# Altium project VM02_hv2.PrjPcb
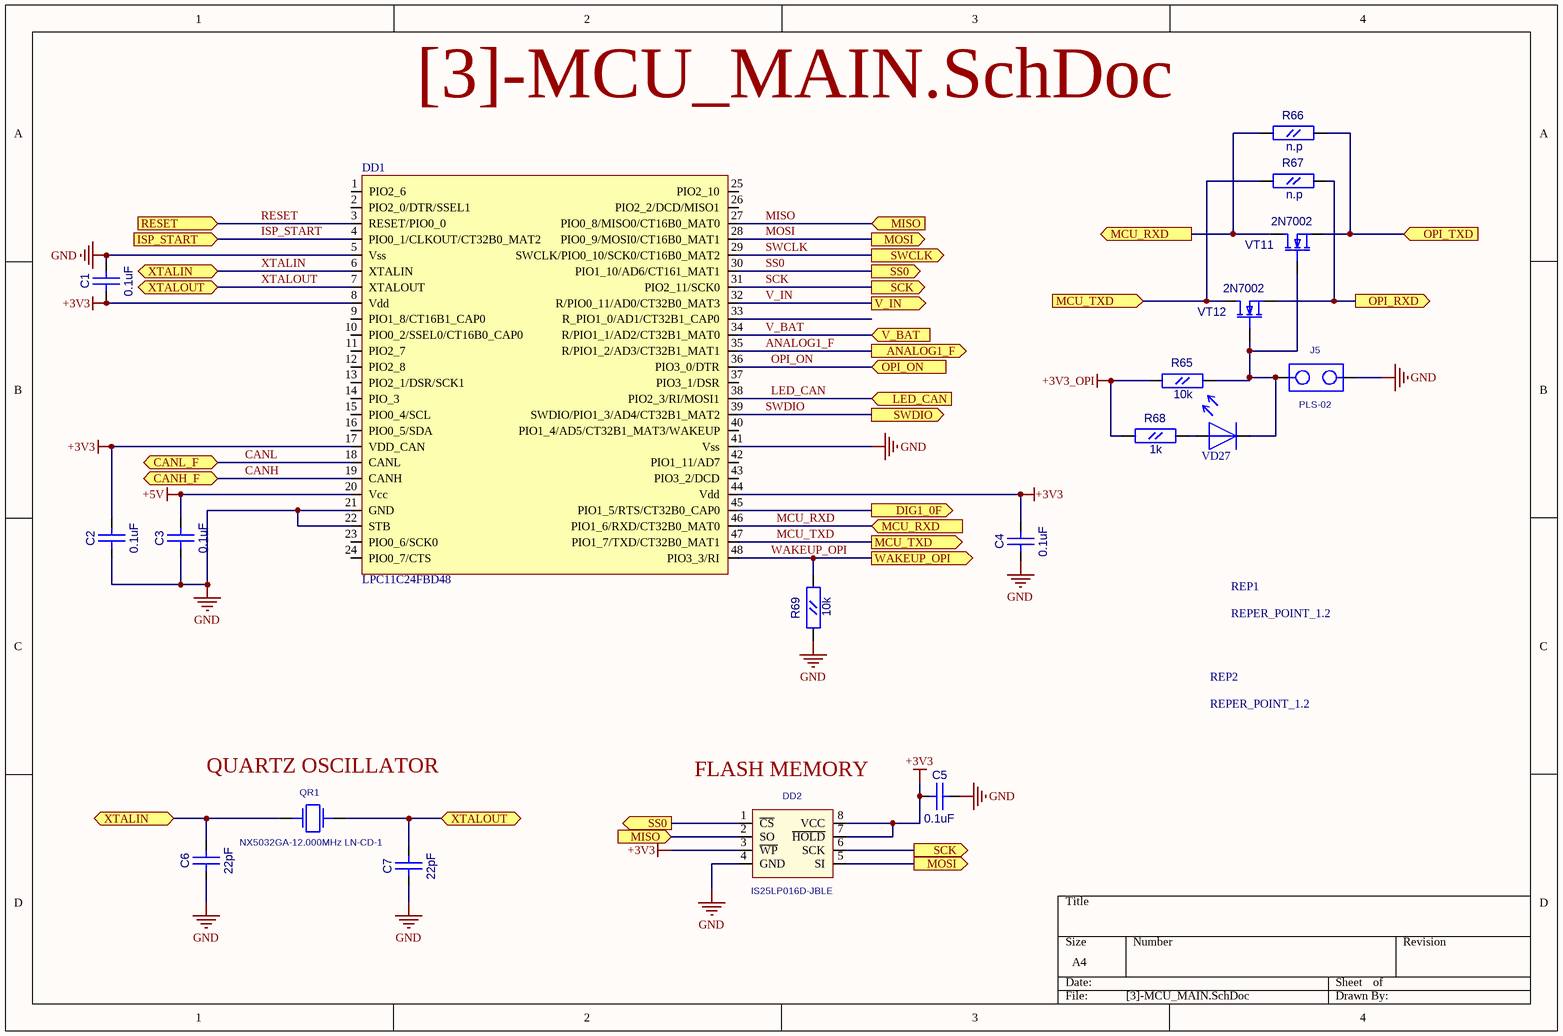
[diagram p0: [3]-MCU_MAIN.SchDoc]
10 sheets, 154 parts. Net scope: flat (ports and power ports of the same name join across sheets).
Board file: VM02_hv2.PcbDoc
Sheets:
  [3]-MCU_MAIN.SchDoc
  [4]-MCU_POWER.SchDoc
  [5]-OPI_MAIN.SchDoc
  [7]-GSM_MODEM_MAIN.SchDoc
  [8]-GSM_MODEM_CONNECTORS.SchDoc
  [9]-CAMERA_POWER_CONTROLLER.SchDoc
  [10]-MAIN_POWER.SchDoc
  [11]-BATTERY_BACKUP.SchDoc
  [14]-MAIN_CONNECTORS.SchDoc
  [15]-MCU_CONNECTORS.SchDoc

## Sheet [3]-MCU_MAIN.SchDoc
size A4

### Parts
C1  0.1uF  [CC0603]
C2  0.1uF  [CC0603]
C3  0.1uF  [CC0603]
C4  0.1uF  [CC0603]
C5  0.1uF  [CC0603]
C6  22pF  [CC0603]
C7  22pF  [CC0603]
DD1  LPC11C24FBD48  [LQFP48]
DD2  IS25LP016D-JBLE  [EIAJ_SO8]
J5  PLS-02  [PLS-02]
QR1  NX5032GA-12.000MHz LN-CD-1  [AC5032_2]
R65  10k  [RC0603]
R66  n.p  [RC0603]
R67  n.p  [RC0603]
R68  1k  [RC0603]
R69  10k  [RC0603]
REP1  REPER_POINT_1.2  [REPER1.2]
REP2  REPER_POINT_1.2  [REPER1.2]
VD27  LED_0805  [LED0805]  (value not drawn)
VT11  2N7002  [SOT-23(123)]
VT12  2N7002  [SOT-23(123)]

### Ports
ANALOG1_F (out), CANH_F (bidir), CANL_F (bidir), DIG1_0F (out), ISP_START (in), LED_CAN (in), MCU_RXD (in), MCU_RXD (out), MCU_TXD (in), MCU_TXD (out), MISO (in), MOSI (out), OPI_ON (in), OPI_RXD (out), OPI_TXD (in), RESET (in), SCK (out), SS0 (out), SWCLK (out), SWDIO (out), V_BAT (in), V_IN (out), WAKEUP_OPI (out), XTALIN (bidir), XTALOUT (bidir)

### Nets
+3V3: C1.1(A) C2.2(B) C4.2(B) C5.1(A) DD1.8(Vdd) DD1.17(VDD_CAN) DD1.44(Vdd) DD2.3(~{WP}) DD2.7(~{HOLD}) DD2.8(VCC)
+3V3_OPI: R65.1(A) R68.1(A)
+5V: C3.2(B) DD1.20(Vcc)
GND: C1.2(B) C2.1(A) C3.1(A) C4.1(A) C5.2(B) C6.1(A) C7.1(A) DD1.5(Vss) DD1.21(GND) DD1.22(STB) DD1.41(Vss) DD2.4(GND) J5.2 R69.1(A)
ANALOG1_F: DD1.35(R/PIO1_2/AD3/CT32B1_MAT1) ; port ANALOG1_F
CANH: DD1.19(CANH) ; port CANH_F
CANL: DD1.18(CANL) ; port CANL_F
ISP_START: DD1.4(PIO0_1/CLKOUT/CT32B0_MAT2) ; port ISP_START
LED_CAN: DD1.38(PIO2_3/RI/MOSI1) ; port LED_CAN
MCU_RXD: DD1.46(PIO1_6/RXD/CT32B0_MAT0) R66.1(A) VT11.3(D) ; port MCU_RXD
MCU_TXD: DD1.47(PIO1_7/TXD/CT32B0_MAT1) R67.1(A) VT12.3(D) ; port MCU_TXD
MISO: DD1.27(PIO0_8/MISO0/CT16B0_MAT0) DD2.2(SO) ; port MISO
MOSI: DD1.28(PIO0_9/MOSI0/CT16B0_MAT1) DD2.5(SI) ; port MOSI
OPI_ON: DD1.36(PIO3_0/DTR) ; port OPI_ON
RESET: DD1.3(RESET/PIO0_0) ; port RESET
SCK: DD1.31(PIO2_11/SCK0) DD2.6(SCK) ; port SCK
SS0: DD1.30(PIO1_10/AD6/CT161_MAT1) DD2.1(~{CS}) ; port SS0
SWCLK: DD1.29(SWCLK/PIO0_10/SCK0/CT16B0_MAT2) ; port SWCLK
SWDIO: DD1.39(SWDIO/PIO1_3/AD4/CT32B1_MAT2) ; port SWDIO
V_BAT: DD1.34(R/PIO1_1/AD2/CT32B1_MAT0) ; port V_BAT
V_IN: DD1.32(R/PIO0_11/AD0/CT32B0_MAT3) ; port V_IN
WAKEUP_OPI: DD1.48(PIO3_3/RI) R69.2(B) ; port WAKEUP_OPI
XTALIN: C6.2(B) DD1.6(XTALIN) QR1.1 ; port XTALIN
XTALOUT: C7.2(B) DD1.7(XTALOUT) QR1.2 ; port XTALOUT
NetDD1_45: DD1.45(PIO1_5/RTS/CT32B0_CAP0) ; port DIG1_0F
NetJ5_1: J5.1 R65.2(B) VD27.2 VT11.1(G) VT12.1(G)
NetR66_2: R66.2(B) VT11.2(S) ; port OPI_TXD
NetR67_2: R67.2(B) VT12.2(S) ; port OPI_RXD
NetR68_2: R68.2(B) VD27.1

Not connected (* = marked no-connect by the designer): DD1 1(PIO2_6) 2(PIO2_0/DTR/SSEL1) 9(PIO1_8/CT16B1_CAP0) 10(PIO0_2/SSEL0/CT16B0_CAP0) 11(PIO2_7) 12(PIO2_8) 13(PIO2_1/DSR/SCK1) 14(PIO_3) 15(PIO0_4/SCL) 16(PIO0_5/SDA) 23(PIO0_6/SCK0) 24(PIO0_7/CTS) 25(PIO2_10) 26(PIO2_2/DCD/MISO1) 33(R_PIO1_0/AD1/CT32B1_CAP0) 37(PIO3_1/DSR) 40(PIO1_4/AD5/CT32B1_MAT3/WAKEUP) 42(PIO1_11/AD7) 43(PIO3_2/DCD); REP1 1; REP2 1

### Notes on the sheet
- (near QR1) QUARTZ OSCILLATOR
- (near DD2) FLASH MEMORY

### Library data of the parts
C1-C7 = CC0603
  C1-C5: Value: 0.1uF
  C6 C7: Value: 22pF
DD2 = S25FL016A0LMFI01: Value: IS25LP016D-JBLE
QR1 = AC5032_2: AC5032/2; Value: NX5032GA-12.000MHz LN-CD-1
R65-R69 = RC0603
  R65 R69: Value: 10k
  R66 R67: Value: n.p
  R68: Value: 1k
REP1 REP2 = REPER1.2: Value: REPER_POINT_1.2
VT11 VT12 = 2N7002: N-Channel Enhancement Mode Vertical DMOS FET; OriginalName: 2N7002; Value: *
DD1 = LPC11C24FBD48: Value: LPC11C24FBD48
J5 = PLS-02: Value: *
VD27 = LED_0805: Value: LED_0805

## Sheet [4]-MCU_POWER.SchDoc
size A4
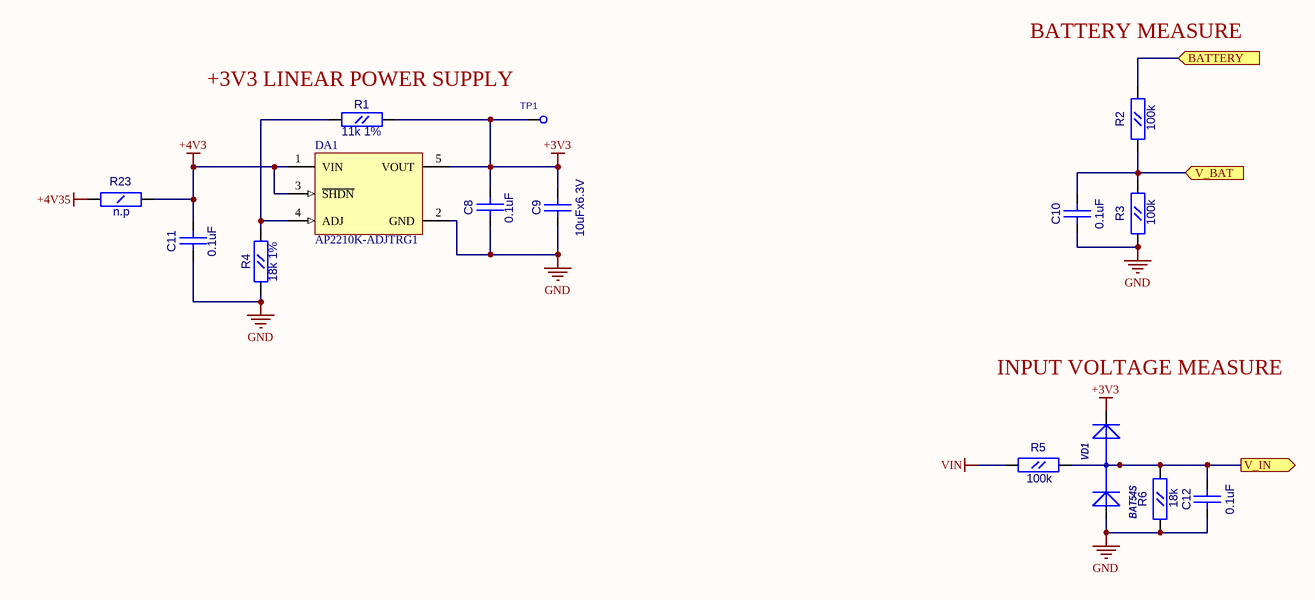
[diagram p1: [4]-MCU_POWER.SchDoc]

### Parts
C8  0.1uF  [CC0603]
C9  10uFx6.3V  [CC0805]
C10  0.1uF  [CC0603]
C11  0.1uF  [CC0603]
C12  0.1uF  [CC0603]
DA1  AP2210K-ADJTRG1  [SOT23-5]
R1  11k 1%  [RC0603]
R2  100k  [RC0603]
R3  100k  [RC0603]
R4  18k 1%  [RC0603]
R5  100k  [RC0603]
R6  18k  [RC0603]
R23  n.p  [RC1206]
TP1  TESTPOINT1  [TESTPOINT1]  (value not drawn)
VD1  BAT54S  [SOT-23(GSD)]

### Ports
BATTERY (in), V_BAT (in), V_IN (out)

### Nets
+3V3: C8.1(A) C9.2(B) DA1.5(VOUT) R1.2(B) TP1.1 VD1.2(K)
+4V3: C11.1(A) DA1.1(VIN) DA1.3(~{SHDN}) R23.2(B)
+4V35: R23.1(A)
+VBAT: R2.2(B) ; port BATTERY
GND: C8.2(B) C9.1(A) C10.1(A) C11.2(B) C12.1(A) DA1.2(GND) R3.1(A) R4.1(A) R6.1(A) VD1.1(A)
VIN: R5.1(A)
V_BAT: C10.2(B) R2.1(A) R3.2(B) ; port V_BAT
V_IN: C12.2(B) R5.2(B) R6.2(B) VD1.3(AK) ; port V_IN
NetDA1_4: DA1.4(ADJ) R1.1(A) R4.2(B)

### Notes on the sheet
- (near R1) +3V3 LINEAR POWER SUPPLY
- BATTERY MEASURE
- (near VD1) INPUT VOLTAGE MEASURE

### Library data of the parts
C8 C10-C12 = CC0603: Value: 0.1uF
C9 = CC0805: Value: 10uFx6.3V
DA1 = MCP1824T-ADJE/OT: 300 mA, Low Voltage, Low Quiescent Current LDO Regulator, 5-Pin SOT-223, Extended Temperature, Tape and Reel; Published: 29-Jan-2009; DatasheetVersion: revA, Aug-2007; PackageVersion: revAW, Oct-2008; PackageReference: SOT-223-DC5; Publisher: Altium Limited; PackageDescription: 5-Lead Plastic Small Outline Transistor (DC) [SOT-223]; ComponentLink1Description: Manufacturer Link; ComponentLink1URL: http://www.microchip.com; ComponentLink2Description: Datasheet; ComponentLink2URL: http://ww1.microchip.com/downloads/en/DeviceDoc/22070a.pdf; ComponentLink3Description: Packaging Specification; ComponentLink3URL: http://ww1.microchip.com/downloads/en/PackagingSpec/00049AW.pdf
R1-R6 = RC0603
  R1: Value: 11k 1%
  R2 R3 R5: Value: 100k
  R4: Value: 18k 1%
  R6: Value: 18k
R23 = RC1206: Value: n.p
VD1 = BAT54S: 1.0 Ampere General Purpose Rectifier; ComponentField6: Published 8-Jun-2000, Modified 11-July-2000: SIM Model Added.; Value: *
TP1 = TESTPOINT1: Value: *

## Sheet [5]-OPI_MAIN.SchDoc
size A4
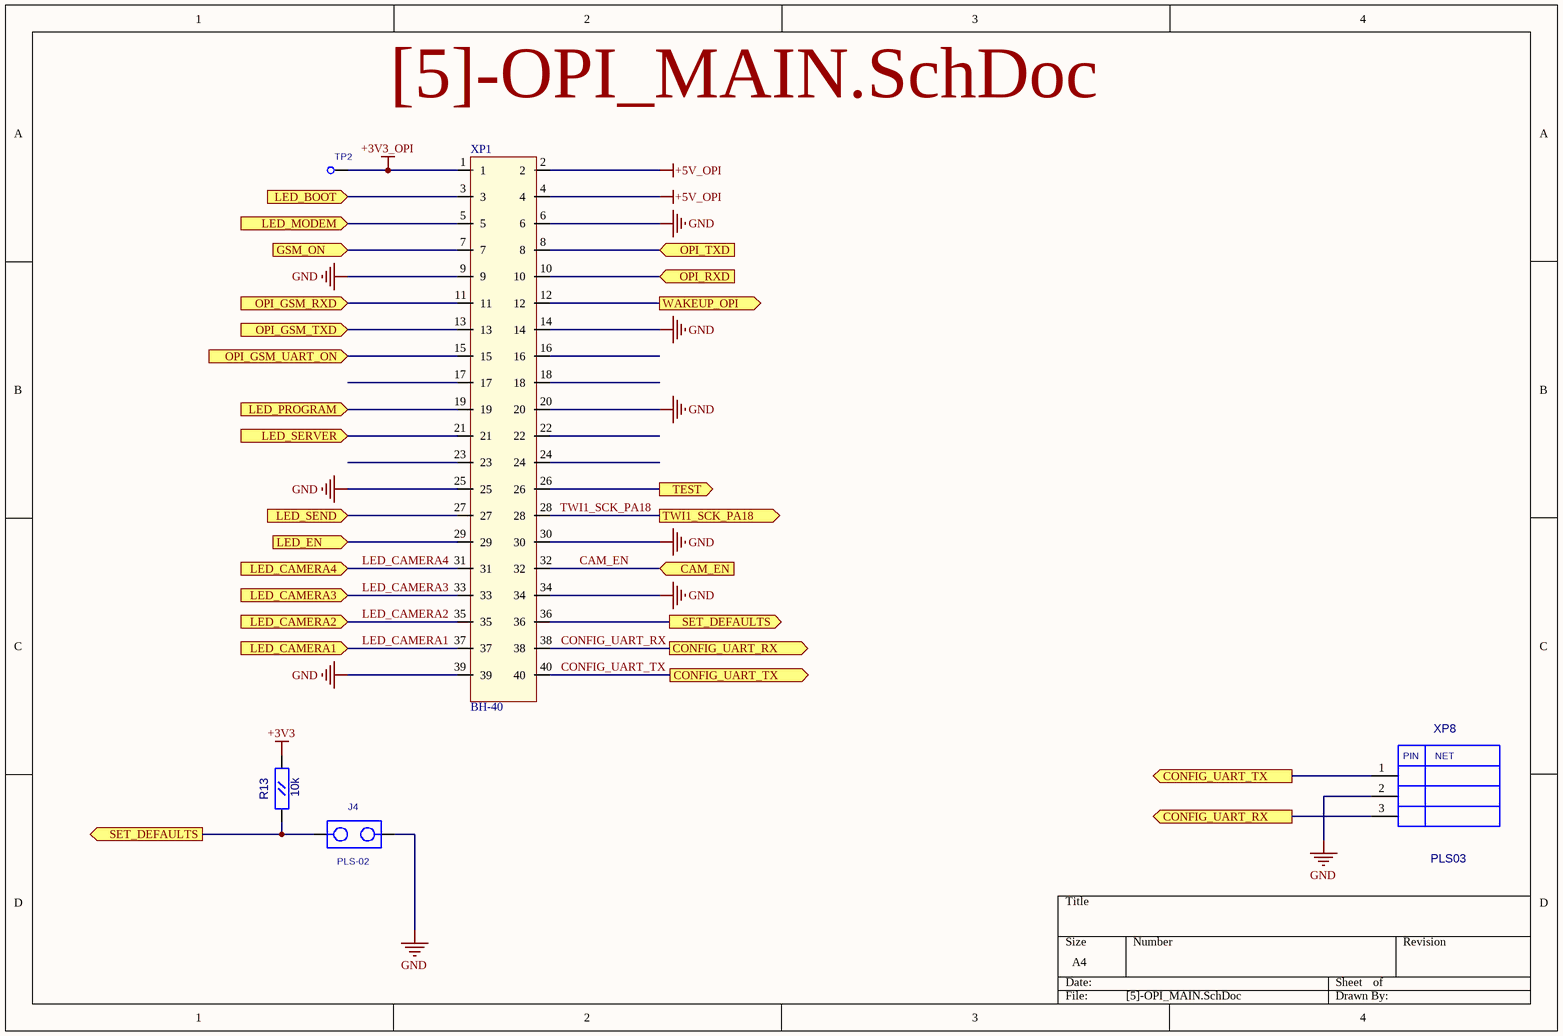
[diagram p2: [5]-OPI_MAIN.SchDoc]

### Parts
J4  PLS-02  [PLS-02]
R13  10k  [RC0603]
TP2  TESTPOINT1  [TESTPOINT1]  (value not drawn)
XP1  BH-40  [BH-40]
XP8  PLS03  [PLS-03]

### Ports
CAM_EN (in), CONFIG_UART_RX (out), CONFIG_UART_TX (out), GSM_ON (in), LED_BOOT (in), LED_CAMERA1 (in), LED_CAMERA2 (in), LED_CAMERA3 (in), LED_CAMERA4 (in), LED_EN (in), LED_MODEM (in), LED_PROGRAM (in), LED_SEND (in), LED_SERVER (in), OPI_GSM_RXD (in), OPI_GSM_TXD (in), OPI_GSM_UART_ON (in), OPI_RXD (in), OPI_TXD (in), SET_DEFAULTS (out), TEST (out), TWI1_SCK_PA18 (out), WAKEUP_OPI (out)

### Nets
+3V3: R13.2(B)
+3V3_OPI: TP2.1 XP1.1
+5V_OPI: XP1.2 XP1.4
GND: J4.2 XP1.6 XP1.9 XP1.14 XP1.20 XP1.25 XP1.30 XP1.34 XP1.39 XP8.2
CAM_EN: XP1.32 ; port CAM_EN
CONFIG_UART_RX: XP1.38 XP8.3 ; port CONFIG_UART_RX
CONFIG_UART_TX: XP1.40 XP8.1 ; port CONFIG_UART_TX
LED_CAMERA1: XP1.37 ; port LED_CAMERA1
LED_CAMERA2: XP1.35 ; port LED_CAMERA2
LED_CAMERA3: XP1.33 ; port LED_CAMERA3
LED_CAMERA4: XP1.31 ; port LED_CAMERA4
TWI1_SCK_PA18: XP1.28 ; port TWI1_SCK_PA18
WAKEUP_OPI: XP1.12 ; port WAKEUP_OPI
NetJ4_1: J4.1 R13.1(A) XP1.36 ; port SET_DEFAULTS
NetR16_2: XP1.7 ; port GSM_ON
NetR18_1: XP1.15 ; port OPI_GSM_UART_ON
NetR63_1: XP1.26 ; port TEST
NetR66_2: XP1.8 ; port OPI_TXD
NetR67_2: XP1.10 ; port OPI_RXD
NetR71_1: XP1.29 ; port LED_EN
NetVT5_3: XP1.13 ; port OPI_GSM_TXD
NetVT6_3: XP1.11 ; port OPI_GSM_RXD
NetXP1_3: XP1.3 ; port LED_BOOT
NetXP1_5: XP1.5 ; port LED_MODEM
NetXP1_19: XP1.19 ; port LED_PROGRAM
NetXP1_21: XP1.21 ; port LED_SERVER
NetXP1_27: XP1.27 ; port LED_SEND

Not connected (* = marked no-connect by the designer): XP1 16 17 18 22 23 24

### Notes on the sheet
- (in symbol PLS03) PIN; NET

### Library data of the parts
R13 = RC0603: Value: 10k
XP1 = BH-40: 2.54mm connector with key; Value: BH-40
J4 = PLS-02: Value: *
TP2 = TESTPOINT1: Value: *
XP8 = PLS03: Value: *

## Sheet [7]-GSM_MODEM_MAIN.SchDoc
size A4
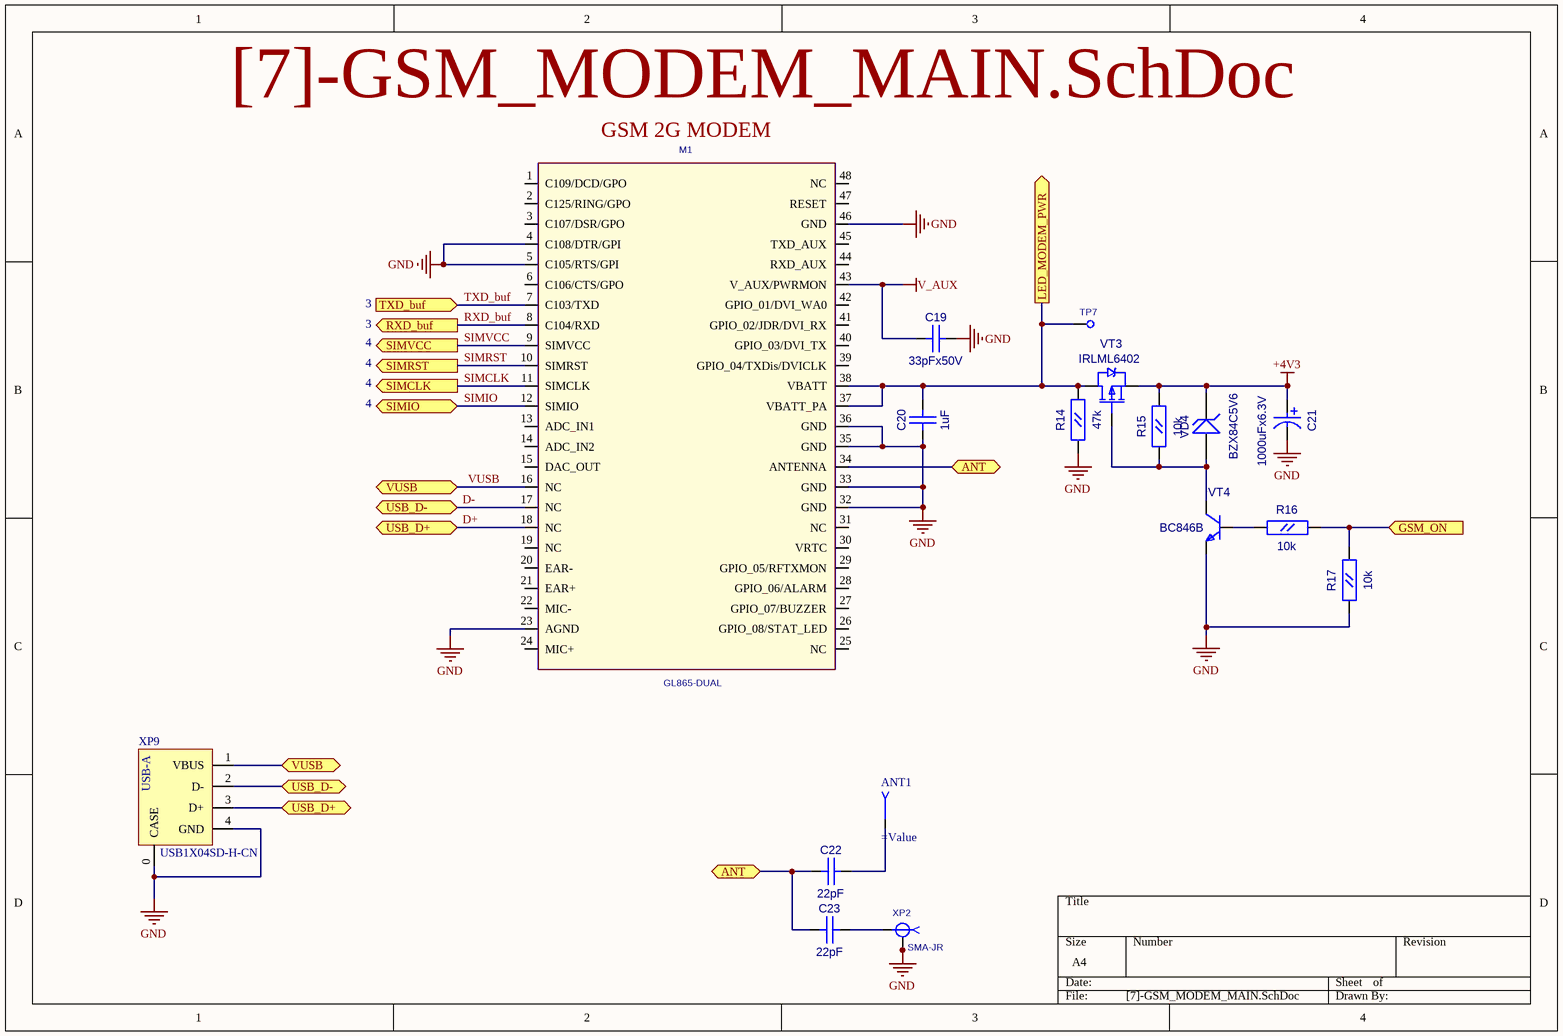
[diagram p3: [7]-GSM_MODEM_MAIN.SchDoc]

### Parts
ANT1  (no value)  [GSM_ANTENNA_MEANDER]
C19  33pFx50V  [CC0603]
C20  1uF  [CC0603]
C21  value 1000uFx6.3V  [CC8X3.5]  (hidden comment: CAP0.35)
C22  22pF  [CC0603]
C23  22pF  [CC0603]
M1  GL865-DUAL  [GL868-DUAL]
R14  47k  [RC0603]
R15  10k  [RC0603]
R16  10k  [RC0603]
R17  10k  [RC0603]
TP7  TESTPOINT1  [TESTPOINT1]  (value not drawn)
VD4  BZX84C5V6  [SOT-23(123)]
VT3  IRLML6402  [SOT-23(123)]
VT4  BC846B  [SOT-23(123)]
XP2  SMA-JR  [SMA-JR]
XP9  USB1X04SD-H-CN  [USB_A_FRONT]

### Ports
ANT (bidir), GSM_ON (in), LED_MODEM_PWR (out), RXD_buf (out), SIMCLK (out), SIMIO (bidir), SIMRST (out), SIMVCC (out), TXD_buf (in), USB_D+ (bidir), USB_D- (bidir), VUSB (bidir)

### Nets
+4V3: C21.1 R15.2(B) VD4.3(K) VT3.2(S)
GND: C19.2(B) C20.1(A) C21.2 M1.4(C108/DTR/GPI) M1.5(C105/RTS/GPI) M1.23(AGND) M1.32(GND) M1.33(GND) M1.35(GND) M1.36(GND) M1.46(GND) R14.1(A) R17.1(A) VT4.2(E) XP2.2 XP2.3 XP2.4 XP2.5 XP9.0(CASE) XP9.4(GND)
V_AUX: C19.1(A) M1.43(V_AUX/PWRMON)
D+: M1.18(NC) XP9.3(D+) ; port USB_D+
D-: M1.17(NC) XP9.2(D-) ; port USB_D-
RXD_buf: M1.8(C104/RXD) ; port RXD_buf
SIMCLK: M1.11(SIMCLK) ; port SIMCLK
SIMIO: M1.12(SIMIO) ; port SIMIO
SIMRST: M1.10(SIMRST) ; port SIMRST
SIMVCC: M1.9(SIMVCC) ; port SIMVCC
TXD_buf: M1.7(C103/TXD) ; port TXD_buf
VUSB: M1.16(NC) XP9.1(VBUS) ; port VUSB
NetANT1_1: ANT1.1 C22.2(B)
NetC20_2: C20.2(B) M1.37(VBATT_PA) M1.38(VBATT) R14.2(B) TP7.1 VT3.3(D) ; port LED_MODEM_PWR
NetC22_1: C22.1(A) C23.1(A) M1.34(ANTENNA) ; port ANT
NetC23_2: C23.2(B) XP2.1
NetR15_1: R15.1(A) VD4.1(A) VT3.1(G) VT4.3(C)
NetR16_1: R16.1(A) VT4.1(B)
NetR16_2: R16.2(B) R17.2(B) ; port GSM_ON

Not connected (* = marked no-connect by the designer): M1 1(C109/DCD/GPO) 2(C125/RING/GPO) 3(C107/DSR/GPO) 6(C106/CTS/GPO) 13(ADC_IN1) 14(ADC_IN2) 15(DAC_OUT) 19(NC) 20(EAR-) 21(EAR+) 22(MIC-) 24(MIC+) 25(NC) 26(GPIO_08/STAT_LED) 27(GPIO_07/BUZZER) 28(GPIO_06/ALARM) 29(GPIO_05/RFTXMON) 30(VRTC) 31(NC) 39(GPIO_04/TXDis/DVICLK) 40(GPIO_03/DVI_TX) 41(GPIO_02/JDR/DVI_RX) 42(GPIO_01/DVI_WA0) 44(RXD_AUX) 45(TXD_AUX) 47(RESET) 48(NC)

### Notes on the sheet
- (near M1) GSM 2G MODEM
- 3
- 4
- (in symbol USB_A_VERTICAL) USB-A

### Library data of the parts
ANT1 = GSM_ANTENNA_MEANDR: 900-1800 Meandered GSM antenna 1.6mm FR4
C19 C20 C22 C23 = CC0603
  C19: Value: 33pFx50V
  C20: Value: 1uF
  C22 C23: Value: 22pF
M1 = GL868-DUAL: Value: *
R14-R17 = RC0603
  R14: Value: 47k
  R15-R17: Value: 10k
VD4 = BZX84: Zener Voltage Regulator Diode; Value: BZX84C5V6
VT3 = IRLML6402: HEXFET Power MOSFET; OriginalName: IRLML5103; ComponentField7: Published 8-Jun-2000; Value: IRLML6402
VT4 = BC846BLT1: ComponentField7: Published 29-Sep-2000; OriginalName: BC846BLT1; Value: BC846B
XP9 = USB_A_VERTICAL: Vertical USB connetctor,type A.THR; Value: USB1X04SD-H-CN
TP7 = TESTPOINT1: Value: *
XP2 = SMA-JR: Value: *

## Sheet [8]-GSM_MODEM_CONNECTORS.SchDoc
size A4
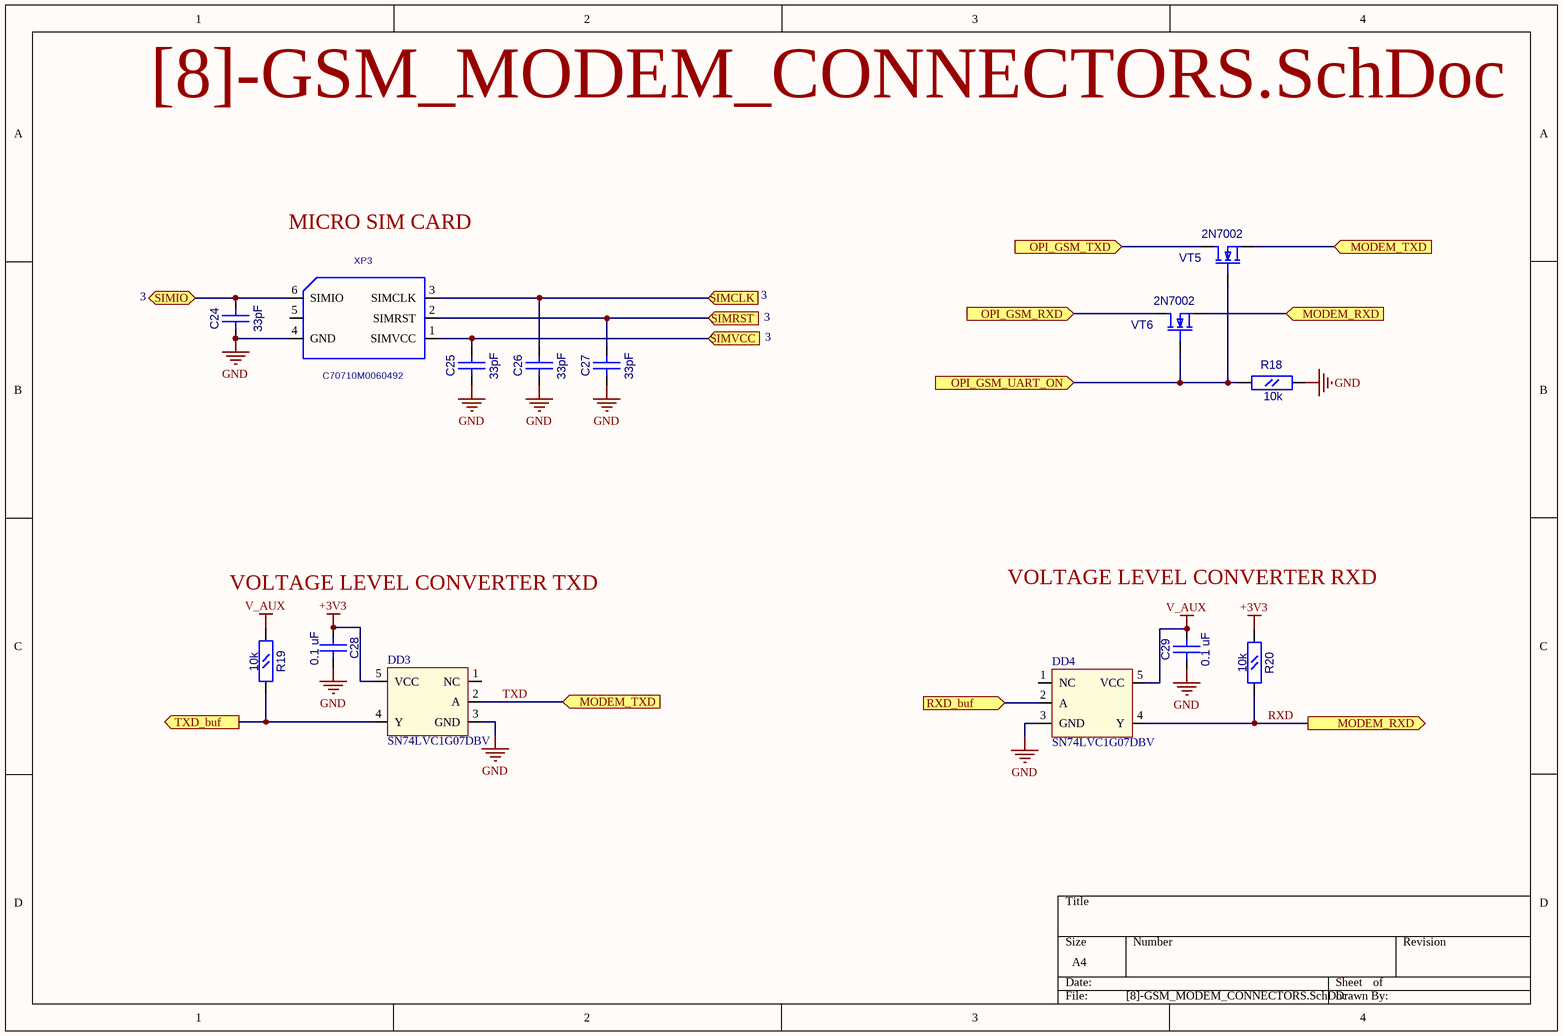
[diagram p4: [8]-GSM_MODEM_CONNECTORS.SchDoc]

### Parts
C24  33pF  [CC0603]
C25  33pF  [CC0603]
C26  33pF  [CC0603]
C27  33pF  [CC0603]
C28  0.1 uF  [CC0603]
C29  0.1 uF  [CC0603]
DD3  SN74LVC1G07DBV  [SOT23-5]
DD4  SN74LVC1G07DBV  [SOT23-5]
R18  10k  [RC0603]
R19  10k  [RC0603]
R20  10k  [RC0603]
VT5  2N7002  [SOT-23(123)]
VT6  2N7002  [SOT-23(123)]
XP3  C70710M0060492  [SCVW06A25020]

### Ports
MODEM_RXD (in), MODEM_RXD (out), MODEM_TXD (in), OPI_GSM_RXD (in), OPI_GSM_TXD (in), OPI_GSM_UART_ON (in), RXD_buf (in), SIMCLK (in), SIMIO (bidir), SIMRST (in), SIMVCC (in), TXD_buf (out)

### Nets
+3V3: C28.2(B) DD3.5(VCC) R20.1(A)
GND: C24.1(A) C25.1(A) C26.1(A) C27.1(A) C28.1(A) C29.1(A) DD3.3(GND) DD4.3(GND) R18.2(B) XP3.4(GND)
V_AUX: C29.2(B) DD4.5(VCC) R19.1(A)
RXD: DD4.4(Y) R20.2(B) VT6.2(S) ; port MODEM_RXD
RXD_buf: DD4.2(A) ; port RXD_buf
SIMCLK: C26.2(B) XP3.3(SIMCLK) ; port SIMCLK
SIMIO: C24.2(B) XP3.6(SIMIO) ; port SIMIO
SIMRST: C27.2(B) XP3.2(SIMRST) ; port SIMRST
SIMVCC: C25.2(B) XP3.1(SIMVCC) ; port SIMVCC
TXD: DD3.2(A) VT5.2(S) ; port MODEM_TXD
TXD_buf: DD3.4(Y) R19.2(B) ; port TXD_buf
NetR18_1: R18.1(A) VT5.1(G) VT6.1(G) ; port OPI_GSM_UART_ON
NetVT5_3: VT5.3(D) ; port OPI_GSM_TXD
NetVT6_3: VT6.3(D) ; port OPI_GSM_RXD

Not connected (* = marked no-connect by the designer): DD3 1(NC); DD4 1(NC); XP3 5

### Notes on the sheet
- MICRO SIM CARD
- 3
- VOLTAGE LEVEL CONVERTER RXD
- VOLTAGE LEVEL CONVERTER TXD

### Library data of the parts
C24-C29 = CC0603
  C24-C27: Value: 33pF
  C28 C29: Value: 0.1 uF
DD3 DD4 = SN74LVC1G07DBV: Open Drain Single Bus Bufer
R18-R20 = RC0603: Value: 10k
VT5 VT6 = 2N7002: as VT11 on sheet [3]-MCU_MAIN; OriginalName: 2N7002; Value: *
XP3 = SCV-W06A25-020: Value: *

## Sheet [9]-CAMERA_POWER_CONTROLLER.SchDoc
size A4
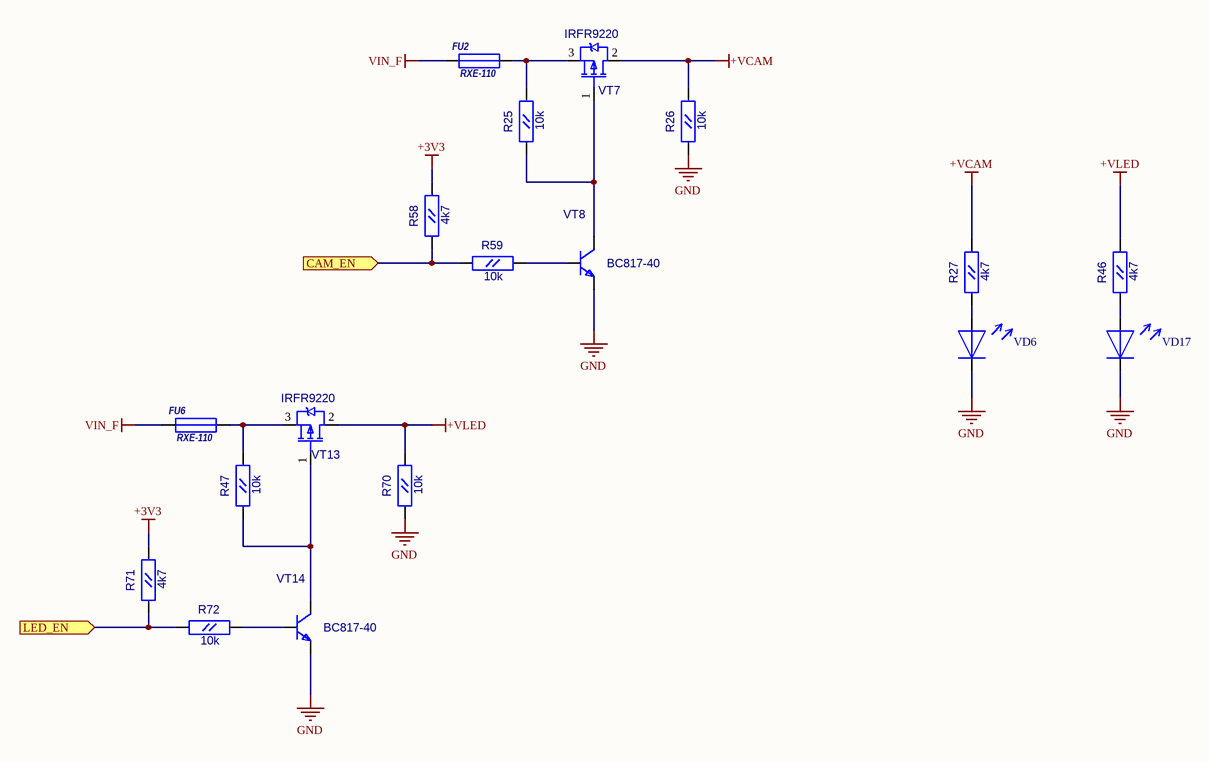
[diagram p5: [9]-CAMERA_POWER_CONTROLLER.SchDoc]

### Parts
FU2  RXE-110  [RXE-110]
FU6  RXE-110  [RXE-110]
R25  10k  [RC0603]
R26  10k  [RC0603]
R27  4k7  [RC0603]
R46  4k7  [RC0603]
R47  10k  [RC0603]
R58  4k7  [RC0603]
R59  10k  [RC0603]
R70  10k  [RC0603]
R71  4k7  [RC0603]
R72  10k  [RC0603]
VD6  LED_0805  [LED0805]  (value not drawn)
VD17  LED_0805  [LED0805]  (value not drawn)
VT7  IRFR9220  [D-PAK(TO-252AA)]
VT8  BC817-40  [SOT-23(123)]
VT13  IRFR9220  [D-PAK(TO-252AA)]
VT14  BC817-40  [SOT-23(123)]

### Ports
CAM_EN (in), LED_EN (in)

### Nets
+3V3: R58.2(B) R71.2(B)
+VCAM: R26.2(B) R27.2(B) VT7.2(D)
+VLED: R46.2(B) R70.2(B) VT13.2(D)
GND: R26.1(A) R70.1(A) VD6.2 VD17.2 VT8.2(E) VT14.2(E)
VIN_F: FU2.1 FU6.1
CAM_EN: R58.1(A) R59.1(A) ; port CAM_EN
NetFU2_2: FU2.2 R25.2(B) VT7.3(S)
NetFU6_2: FU6.2 R47.2(B) VT13.3(S)
NetR25_1: R25.1(A) VT7.1(G) VT8.3(C)
NetR27_1: R27.1(A) VD6.1
NetR46_1: R46.1(A) VD17.1
NetR47_1: R47.1(A) VT13.1(G) VT14.3(C)
NetR59_2: R59.2(B) VT8.1(B)
NetR71_1: R71.1(A) R72.1(A) ; port LED_EN
NetR72_2: R72.2(B) VT14.1(B)

### Library data of the parts
R25-R27 R46 R47 R58 R59 R70-R72 = RC0603
  R25 R26 R47 R59 R70 R72: Value: 10k
  R27 R46 R58 R71: Value: 4k7
VT7 VT13 = IRFR9220: HEXFET Power MOSFET; OriginalName: IRLML5103; ComponentField7: Published 8-Jun-2000; Value: IRFR9220
VT8 VT14 = BC846BLT1: NPN 500ma transistor; ComponentField7: Published 29-Sep-2000; OriginalName: BC846BLT1; Value: BC817-40
FU2 FU6 = RXE-110: Value: *
VD6 VD17 = LED_0805: Value: LED_0805

## Sheet [10]-MAIN_POWER.SchDoc
size A4
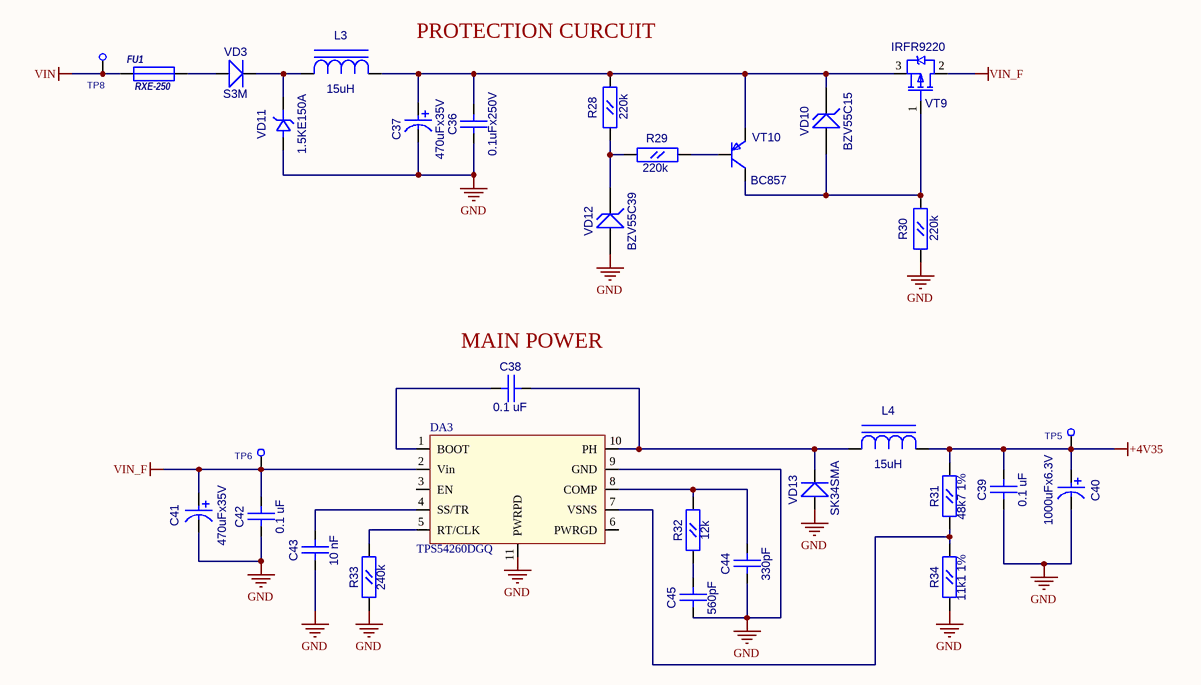
[diagram p6: [10]-MAIN_POWER.SchDoc]

### Parts
C36  0.1uFx250V  [CC1206]
C37  value 470uFx35V  [CC16X10_CAP0.5(1)(Primary)]  (hidden comment: CAP0.5(1))
C38  0.1 uF  [CC0603]
C39  0.1 uF  [CC0603]
C40  1000uFx6.3V  [CC8X3.5]
C41  470uFx35V  [CC16X10_CAP0.5(1)(Primary)]
C42  0.1 uF  [CC0603]
C43  10 nF  [CC0603]
C44  330pF  [CC0603]
C45  560pF  [CC0603]
DA3  TPS54260DGQ  [S-PDSO-G10]
FU1  RXE-250  [RXE-185]
L3  value 15uH  [SDR0805]  (hidden comment: SDR0805)
L4  15uH  [SDR0805]
R28  220k  [RC0603]
R29  220k  [RC0603]
R30  220k  [RC0603]
R31  48k7 1%  [RC0603]
R32  12k  [RC0603]
R33  240k  [RC0603]
R34  11k1 1%  [RC0603]
TP5  TESTPOINT1  [TESTPOINT1]  (value not drawn)
TP6  TESTPOINT1  [TESTPOINT1]  (value not drawn)
TP8  TESTPOINT1  [TESTPOINT1]  (value not drawn)
VD3  S3M  [SMC]
VD10  BZV55C15  [SOD-80]
VD11  1.5KE150A  [DO-201]
VD12  BZV55C39  [SOD-80]
VD13  SK34SMA  [SMA]
VT9  IRFR9220  [D-PAK(TO-252AA)]
VT10  BC857  [SOT-23(123)]

### Nets
+4V35: C39.1(A) C40.1 L4.2(A) R31.2(B) TP5.1
GND: C36.1(A) C37.1 C39.2(B) C40.2 C41.1 C42.2(B) C43.2(B) C44.2(B) C45.2(B) DA3.9(GND) DA3.11(PWRPD) R30.1(A) R33.1(A) R34.1(A) VD11.1(A) VD12.1(A) VD13.1(A)
VIN: FU1.1 TP8.1
VIN_F: C41.2 C42.1(A) DA3.2(Vin) TP6.1 VT9.2(D)
NetC36_2: C36.2(B) C37.2 L3.2(A) R28.2(B) VD10.2 VT9.3(S) VT10.2(E)
NetC38_1: C38.1(A) DA3.10(PH) L4.1(C) VD13.2(K)
NetC38_2: C38.2(B) DA3.1(BOOT)
NetC43_1: C43.1(A) DA3.4(SS/TR)
NetC44_1: C44.1(A) DA3.8(COMP) R32.2(B)
NetC45_1: C45.1(A) R32.1(A)
NetDA3_5: DA3.5(RT/CLK) R33.2(B)
NetDA3_7: DA3.7(VSNS) R31.1(A) R34.2(B)
NetFU1_2: FU1.2 VD3.1(A)
NetL3_1: L3.1(C) VD3.2(K) VD11.2(K)
NetR28_1: R28.1(A) R29.2(B) VD12.2
NetR29_1: R29.1(A) VT10.1(B)
NetR30_2: R30.2(B) VD10.1(A) VT9.1(G) VT10.3(C)

Not connected (* = marked no-connect by the designer): DA3 3(EN) 6(PWRGD)

### Notes on the sheet
- PROTECTION CURCUIT
- (near C38) MAIN POWER

### Library data of the parts
C36 = CC1206: Value: 0.1uFx250V
C38 C39 C42-C45 = CC0603
  C38 C39 C42: Value: 0.1 uF
  C43: Value: 10 nF
  C44: Value: 330pF
  C45: Value: 560pF
C40 = CAP0.35: Value: 1000uFx6.3V
C41 = CAP0.5(1): Value: 470uFx35V
FU1 = RXE-185: Value: *
L4 = SDR0805: Value: 15uH
R28-R34 = RC0603
  R28-R30: Value: 220k
  R31: Value: 48k7 1%
  R32: Value: 12k
  R33: Value: 240k
  R34: Value: 11k1 1%
VD3 = S3A: Schottky Rectifier; Value: S3M
VD10 = BZV55C12: Zener Voltage Regulator Diode; Value: BZV55C15
VD11 = 1.5KE: Value: 1.5KE150A
VD12 = BZV55C12: Zener Voltage Regulator Diode; OriginalName: BXV55C39; ComponentField6: Pin 2 is not connected and not drawn.; ComponentField7: Published 29-Sep-2000; Value: BZV55C39
VD13 = SK34SMA: Schottky Rectifier; Value: {Value}
VT9 = IRFR9220: as VT7 on sheet [9]-CAMERA_POWER_CONTROLLER; Value: IRFR9220
VT10 = BC857B: PNP 100ma transistor; OriginalName: BC846BLT1; ComponentField7: Published 29-Sep-2000; Value: BC857
TP5 TP6 TP8 = TESTPOINT1: Value: *

## Sheet [11]-BATTERY_BACKUP.SchDoc
size A4
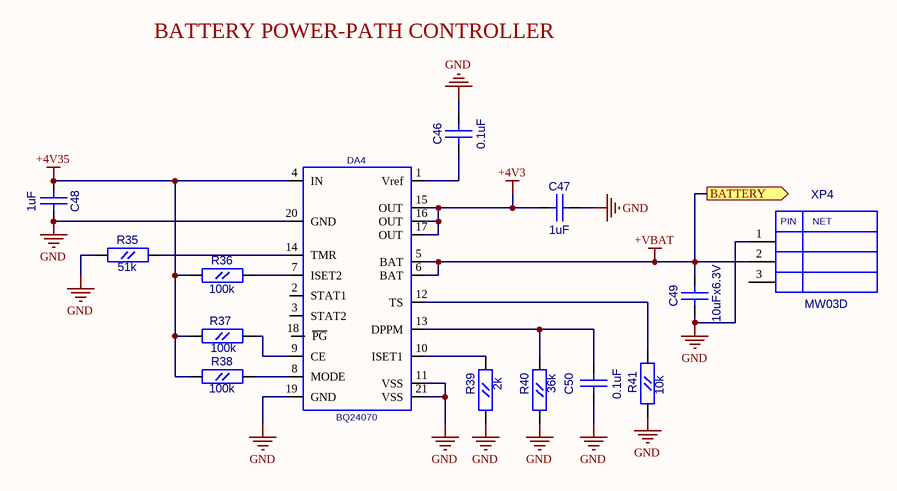
[diagram p7: [11]-BATTERY_BACKUP.SchDoc]

### Parts
C46  0.1uF  [CC0603]
C47  1uF  [CC0603]
C48  1uF  [CC0603]
C49  10uFx6.3V  [CC0805]
C50  0.1uF  [CC0603]
DA4  BQ24070  [P-PQFP-N20]
R35  51k  [RC0603]
R36  100k  [RC0603]
R37  100k  [RC0603]
R38  100k  [RC0603]
R39  2k  [RC0603]
R40  36k  [RC0603]
R41  10k  [RC0603]
XP4  MW03D  [MW03D]

### Ports
BATTERY (out)

### Nets
+4V3: C47.1(A) DA4.15(OUT) DA4.16(OUT) DA4.17(OUT)
+4V35: C48.1(A) DA4.4(IN) R36.2(B) R37.2(B) R38.2(B)
+VBAT: C49.2(B) DA4.5(BAT) DA4.6(BAT) XP4.2 ; port BATTERY
GND: C46.2(B) C47.2(B) C48.2(B) C49.1(A) C50.2(B) DA4.11(VSS) DA4.19(GND) DA4.20(GND) DA4.21(VSS) R35.2(B) R39.2(B) R40.2(B) R41.2(B) XP4.1
NetC46_1: C46.1(A) DA4.1(Vref)
NetC50_1: C50.1(A) DA4.13(DPPM) R40.1(A)
NetDA4_7: DA4.7(ISET2) R36.1(A)
NetDA4_8: DA4.8(MODE) R38.1(A)
NetDA4_9: DA4.9(CE) R37.1(A)
NetDA4_10: DA4.10(ISET1) R39.1(A)
NetDA4_12: DA4.12(TS) R41.1(A)
NetDA4_14: DA4.14(TMR) R35.1(A)

Not connected (* = marked no-connect by the designer): DA4 2(STAT1) 3(STAT2) 18(~{PG}); XP4 3

### Notes on the sheet
- BATTERY POWER-PATH CONTROLLER
- (in symbol MW03D) PIN; NET

### Library data of the parts
C46-C48 C50 = CC0603
  C46 C50: Value: 0.1uF
  C47 C48: Value: 1uF
C49 = CC0805: Value: 10uFx6.3V
R35-R41 = RC0603
  R35: Value: 51k
  R36-R38: Value: 100k
  R39: Value: 2k
  R40: Value: 36k
  R41: Value: 10k
DA4 = BQ24070: Value: *
XP4 = MW03D: Value: *

## Sheet [14]-MAIN_CONNECTORS.SchDoc
size A4
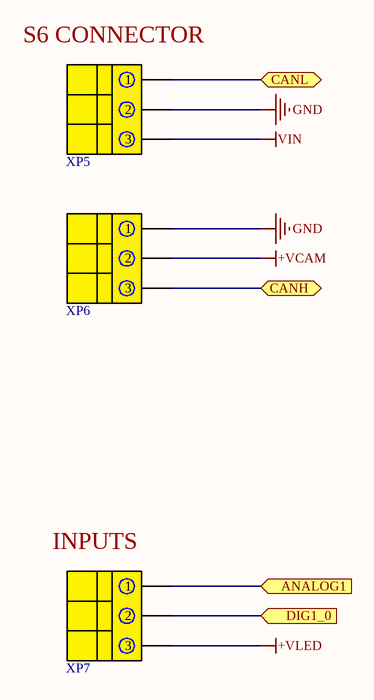
[diagram p8: [14]-MAIN_CONNECTORS.SchDoc]

### Parts
XP5  DG330-3PIN  [DG330-3P]  (value not drawn)
XP6  DG330-3PIN  [DG330-3P]  (value not drawn)
XP7  DG330-3PIN  [DG330-3P]  (value not drawn)

### Ports
ANALOG1 (in), CANH (bidir), CANL (bidir), DIG1_0 (in)

### Nets
+VCAM: XP6.2
+VLED: XP7.3
GND: XP5.2 XP6.1
VIN: XP5.3
NetFU4_2: XP5.1 ; port CANL
NetFU5_2: XP6.3 ; port CANH
NetXP7_1: XP7.1 ; port ANALOG1
NetXP7_2: XP7.2 ; port DIG1_0

### Notes on the sheet
- (near XP5) S6 CONNECTOR
- (near XP7) INPUTS

### Library data of the parts
XP5-XP7 = DG330-3P: Degson 3 pin connector rear; Value: DG330-3PIN

## Sheet [15]-MCU_CONNECTORS.SchDoc
size A4
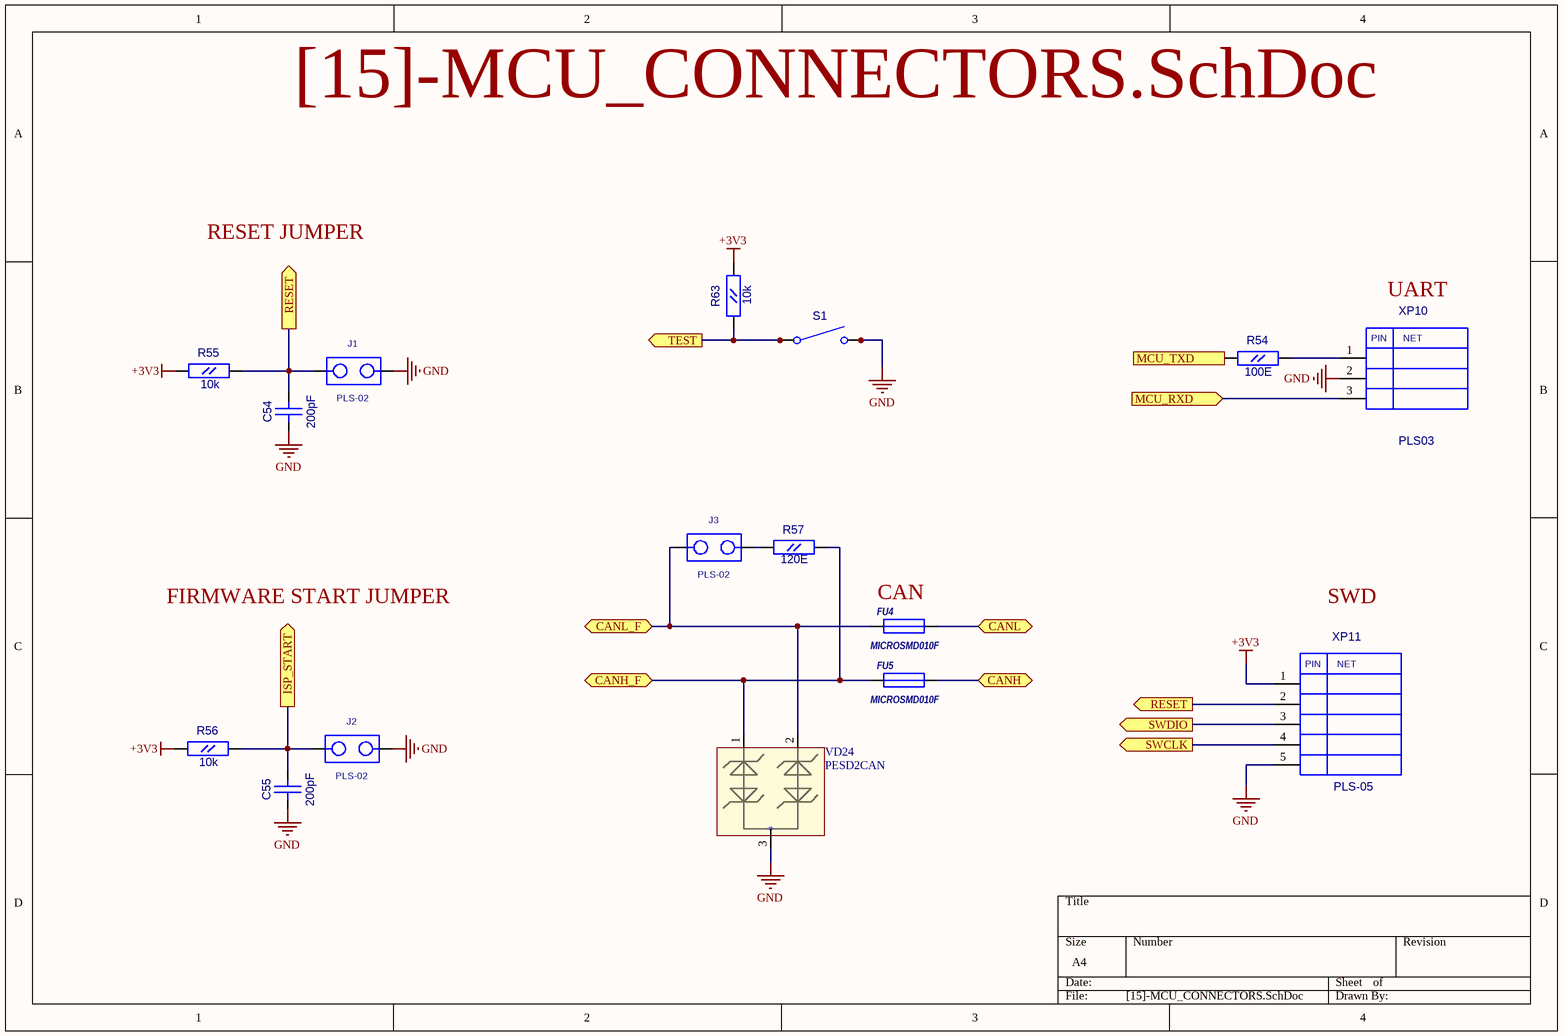
[diagram p9: [15]-MCU_CONNECTORS.SchDoc]

### Parts
C54  200pF  [CC0603]
C55  200pF  [CC0603]
FU4  MICROSMD010F  [RC1210]
FU5  MICROSMD010F  [RC1210]
J1  PLS-02  [PLS-02]
J2  PLS-02  [PLS-02]
J3  PLS-02  [PLS-02]
R54  100E  [RC0603]
R55  10k  [RC0603]
R56  10k  [RC0603]
R57  120E  [RC0805]
R63  10k  [RC0603]
S1  DTSM-61N  [DTSM-61N]  (value not drawn)
VD24  PESD2CAN  [SOT-23(123)]
XP10  PLS03  [PLS-03]
XP11  PLS-05  [PLS-05]

### Ports
CANH (bidir), CANH_F (bidir), CANL (bidir), CANL_F (bidir), ISP_START (out), MCU_RXD (in), MCU_TXD (out), RESET (out), SWCLK (out), SWDIO (out), TEST (out)

### Nets
+3V3: R55.1(A) R56.1(A) R63.2(B) XP11.1
GND: C54.1(A) C55.1(A) J1.2 J2.2 S1.3(C2) S1.4 VD24.3 XP10.2 XP11.5
CANH: FU5.1 R57.2(B) VD24.1 ; port CANH_F
CANL: FU4.1 J3.1 VD24.2 ; port CANL_F
ISP_START: C55.2(B) J2.1 R56.2(B) ; port ISP_START
MCU_RXD: XP10.3 ; port MCU_RXD
MCU_TXD: R54.1(A) ; port MCU_TXD
RESET: C54.2(B) J1.1 R55.2(B) XP11.2 ; port RESET
SWCLK: XP11.4 ; port SWCLK
SWDIO: XP11.3 ; port SWDIO
NetFU4_2: FU4.2 ; port CANL
NetFU5_2: FU5.2 ; port CANH
NetJ3_2: J3.2 R57.1(A)
NetR54_2: R54.2(B) XP10.1
NetR63_1: R63.1(A) S1.1(C1) S1.2 ; port TEST

### Notes on the sheet
- RESET JUMPER
- UART
- FIRMWARE START JUMPER
- (near FU4) CAN
- SWD
- (in symbol PLS03) PIN; NET
- (in symbol PLS-05) PIN; NET

### Library data of the parts
C54 C55 = CC0603: Value: 200pF
FU4 FU5 = MICROSMD: Value: *
R54-R56 R63 = RC0603
  R54: Value: 100E
  R55 R56 R63: Value: 10k
R57 = RC0805: Value: 120E
S1 = DTSM-61N: Switch, Single Pole, Single Throw, Normally Open; Value: {Value}
VD24 = PESD2CAN: TVS for CAN
J1-J3 = PLS-02: Value: *
XP10 = PLS03: Value: *
XP11 = PLS-05: Value: *

## Nets that join several sheets
+3V3: [3]-MCU_MAIN (10 pins), [4]-MCU_POWER (6 pins), [5]-OPI_MAIN (R13.2), [8]-GSM_MODEM_CONNECTORS (C28.2 DD3.5 R20.1), [9]-CAMERA_POWER_CONTROLLER (R58.2 R71.2), [15]-MCU_CONNECTORS (R55.1 R56.1 R63.2 XP11.1)
+3V3_OPI: [3]-MCU_MAIN (R65.1 R68.1), [5]-OPI_MAIN (TP2.1 XP1.1)
+4V3: [4]-MCU_POWER (C11.1 DA1.1 DA1.3 R23.2), [7]-GSM_MODEM_MAIN (C21.1 R15.2 VD4.3 VT3.2), [11]-BATTERY_BACKUP (C47.1 DA4.15 DA4.16 DA4.17)
+4V35: [4]-MCU_POWER (R23.1), [10]-MAIN_POWER (5 pins), [11]-BATTERY_BACKUP (5 pins)
+VBAT: [4]-MCU_POWER (R2.2), [11]-BATTERY_BACKUP (C49.2 DA4.5 DA4.6 XP4.2)
+VCAM: [9]-CAMERA_POWER_CONTROLLER (R26.2 R27.2 VT7.2), [14]-MAIN_CONNECTORS (XP6.2)
+VLED: [9]-CAMERA_POWER_CONTROLLER (R46.2 R70.2 VT13.2), [14]-MAIN_CONNECTORS (XP7.3)
GND: [3]-MCU_MAIN (14 pins), [4]-MCU_POWER (10 pins), [5]-OPI_MAIN (10 pins), [7]-GSM_MODEM_MAIN (20 pins), [8]-GSM_MODEM_CONNECTORS (10 pins), [9]-CAMERA_POWER_CONTROLLER (6 pins), [10]-MAIN_POWER (17 pins), [11]-BATTERY_BACKUP (14 pins), [14]-MAIN_CONNECTORS (XP5.2 XP6.1), [15]-MCU_CONNECTORS (9 pins)
V_AUX: [7]-GSM_MODEM_MAIN (C19.1 M1.43), [8]-GSM_MODEM_CONNECTORS (C29.2 DD4.5 R19.1)
VIN: [4]-MCU_POWER (R5.1), [10]-MAIN_POWER (FU1.1 TP8.1), [14]-MAIN_CONNECTORS (XP5.3)
VIN_F: [9]-CAMERA_POWER_CONTROLLER (FU2.1 FU6.1), [10]-MAIN_POWER (5 pins)
CAM_EN: [5]-OPI_MAIN (XP1.32), [9]-CAMERA_POWER_CONTROLLER (R58.1 R59.1)
CANH: [3]-MCU_MAIN (DD1.19), [15]-MCU_CONNECTORS (FU5.1 R57.2 VD24.1)
CANL: [3]-MCU_MAIN (DD1.18), [15]-MCU_CONNECTORS (FU4.1 J3.1 VD24.2)
ISP_START: [3]-MCU_MAIN (DD1.4), [15]-MCU_CONNECTORS (C55.2 J2.1 R56.2)
MCU_RXD: [3]-MCU_MAIN (DD1.46 R66.1 VT11.3), [15]-MCU_CONNECTORS (XP10.3)
MCU_TXD: [3]-MCU_MAIN (DD1.47 R67.1 VT12.3), [15]-MCU_CONNECTORS (R54.1)
NetFU4_2: [14]-MAIN_CONNECTORS (XP5.1), [15]-MCU_CONNECTORS (FU4.2)
NetFU5_2: [14]-MAIN_CONNECTORS (XP6.3), [15]-MCU_CONNECTORS (FU5.2)
NetR16_2: [5]-OPI_MAIN (XP1.7), [7]-GSM_MODEM_MAIN (R16.2 R17.2)
NetR18_1: [5]-OPI_MAIN (XP1.15), [8]-GSM_MODEM_CONNECTORS (R18.1 VT5.1 VT6.1)
NetR63_1: [5]-OPI_MAIN (XP1.26), [15]-MCU_CONNECTORS (R63.1 S1.1 S1.2)
NetR66_2: [3]-MCU_MAIN (R66.2 VT11.2), [5]-OPI_MAIN (XP1.8)
NetR67_2: [3]-MCU_MAIN (R67.2 VT12.2), [5]-OPI_MAIN (XP1.10)
NetR71_1: [5]-OPI_MAIN (XP1.29), [9]-CAMERA_POWER_CONTROLLER (R71.1 R72.1)
NetVT5_3: [5]-OPI_MAIN (XP1.13), [8]-GSM_MODEM_CONNECTORS (VT5.3)
NetVT6_3: [5]-OPI_MAIN (XP1.11), [8]-GSM_MODEM_CONNECTORS (VT6.3)
RESET: [3]-MCU_MAIN (DD1.3), [15]-MCU_CONNECTORS (C54.2 J1.1 R55.2 XP11.2)
RXD_buf: [7]-GSM_MODEM_MAIN (M1.8), [8]-GSM_MODEM_CONNECTORS (DD4.2)
SIMCLK: [7]-GSM_MODEM_MAIN (M1.11), [8]-GSM_MODEM_CONNECTORS (C26.2 XP3.3)
SIMIO: [7]-GSM_MODEM_MAIN (M1.12), [8]-GSM_MODEM_CONNECTORS (C24.2 XP3.6)
SIMRST: [7]-GSM_MODEM_MAIN (M1.10), [8]-GSM_MODEM_CONNECTORS (C27.2 XP3.2)
SIMVCC: [7]-GSM_MODEM_MAIN (M1.9), [8]-GSM_MODEM_CONNECTORS (C25.2 XP3.1)
SWCLK: [3]-MCU_MAIN (DD1.29), [15]-MCU_CONNECTORS (XP11.4)
SWDIO: [3]-MCU_MAIN (DD1.39), [15]-MCU_CONNECTORS (XP11.3)
TXD_buf: [7]-GSM_MODEM_MAIN (M1.7), [8]-GSM_MODEM_CONNECTORS (DD3.4 R19.2)
V_BAT: [3]-MCU_MAIN (DD1.34), [4]-MCU_POWER (C10.2 R2.1 R3.2)
V_IN: [3]-MCU_MAIN (DD1.32), [4]-MCU_POWER (C12.2 R5.2 R6.2 VD1.3)
WAKEUP_OPI: [3]-MCU_MAIN (DD1.48 R69.2), [5]-OPI_MAIN (XP1.12)